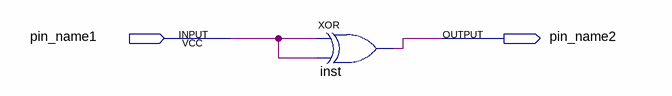
[diagram p0: schematic sheet]
// Quartus schematic Dec2.bdf as structural Verilog: 1 symbols, 2 pins
module Dec2 (
  input  pin_name1,
  output pin_name2
);

  xor inst (pin_name2, pin_name1, pin_name1);
endmodule
